# EAGLE design esp8266-rfid (EAGLE 7.7.0)
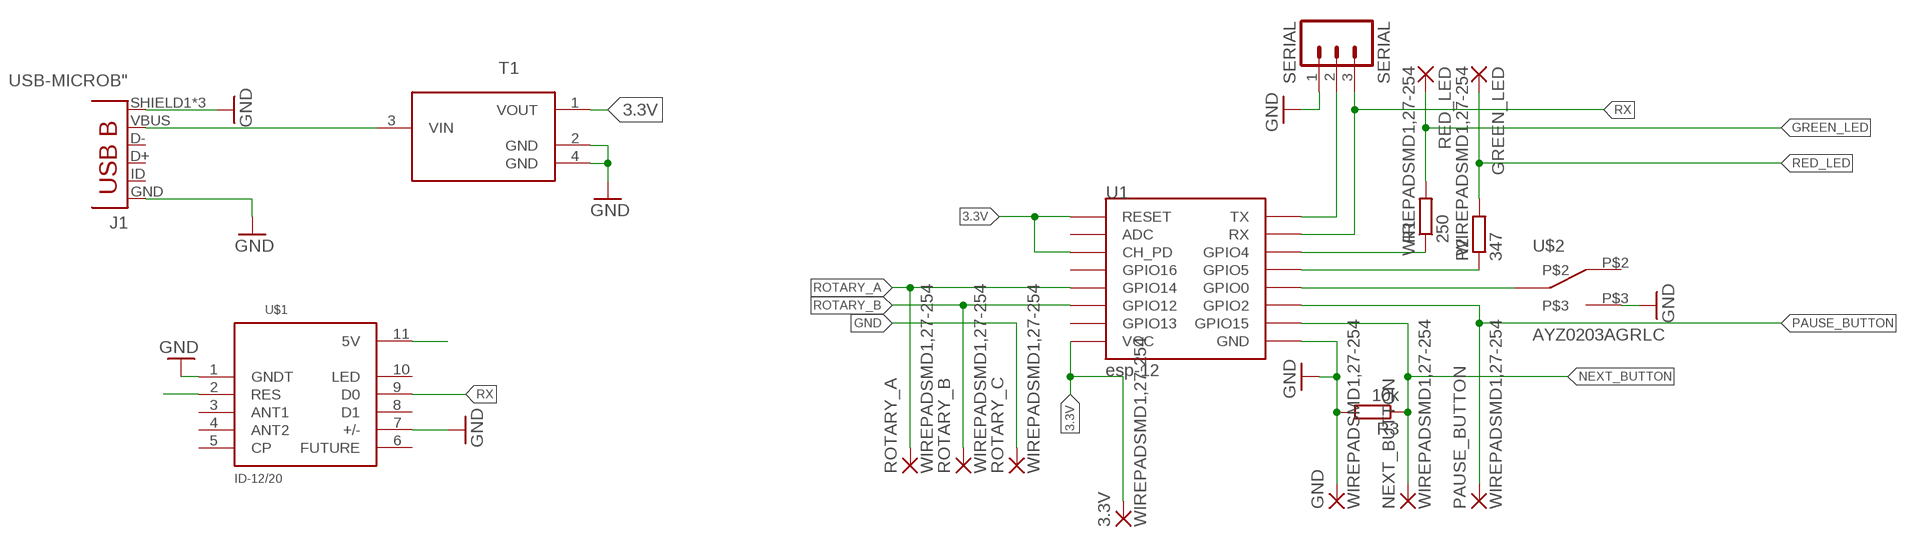
[diagram p0: schematic, sheet 1]

## Parts
3.3V  WIREPADSMD1,27-254  [SMD1,27-2,54]
GND  WIREPADSMD1,27-254  [SMD1,27-2,54]
GREEN_LED  WIREPADSMD1,27-254  [SMD1,27-2,54]
J1  USB-MICROB"  [USB-B-MICRO-SMD_V03]
NEXT_BUTTON  WIREPADSMD1,27-254  [SMD1,27-2,54]
PAUSE_BUTTON  WIREPADSMD1,27-254  [SMD1,27-2,54]
R1  250  R-EU_R0603  [R0603]
R2  347  R-EU_R0603  [R0603]
R3  10k  R-EU_R0603  [R0603]
RED_LED  WIREPADSMD1,27-254  [SMD1,27-2,54]
ROTARY_A  WIREPADSMD1,27-254  [SMD1,27-2,54]
ROTARY_B  WIREPADSMD1,27-254  [SMD1,27-2,54]
ROTARY_C  WIREPADSMD1,27-254  [SMD1,27-2,54]
SERIAL  SERIAL  M03PTH  [1X03]
T1  L78L33ACUTR  [SOT150P400X160-4N]
U1  esp-12  ESP12SMD  [ESP12-SMD]
U$1  ID-12/20  [ID-12]
U$2  AYZ0203AGRLC  [AYZ0203AGRLC]

## Nets
3.3V: 3.3V.1(P) T1.1(VOUT) U1.CH_PD U1.RESET U1.VCC
GND: GND.1(P) J1.GND J1.SHIELD1(SHIELD) J1.SHIELD2(SHIELD) J1.SHIELD3(SHIELD) R3.2 ROTARY_C.1(P) SERIAL.1 T1.2(GND) T1.4(GND) U1.GND U$1.1(GNDT) U$1.7(+/-) U$2.P$3
GREEN_LED: R1.2 RED_LED.1(P)
N$1: U1.GPIO0 U$2.P$1(COM)
N$7: R1.1 U1.GPIO4
NEXT_BUTTON: NEXT_BUTTON.1(P) R3.1 U1.GPIO15
PAUSE_BUTTON: PAUSE_BUTTON.1(P) U1.GPIO2
RED_LED: GREEN_LED.1(P) R2.2
RESET: R2.1 U1.GPIO5
ROTARY_A: ROTARY_A.1(P) U1.GPIO14
ROTARY_B: ROTARY_B.1(P) U1.GPIO12
RX: SERIAL.3 U1.RXD0(RX) U$1.9(D0)
TX: SERIAL.2 U1.TXD0(TX)
VBUS: J1.VBUS T1.3(VIN) U$1.2(RES) U$1.11(5V)
Unconnected: J1.D+ J1.D- J1.ID(USBID) U1.ADC U1.GPIO13 U1.GPIO16 U$1.3(ANT1) U$1.4(ANT2) U$1.5(CP) U$1.6(FUTURE) U$1.8(D1) U$1.10(LED) U$2.P$2

## Library data of the parts
3.3V GND GREEN_LED NEXT_BUTTON PAUSE_BUTTON RED_LED ROTARY_A ROTARY_B ROTARY_C = wirepad:WIREPAD: Wire PAD connect wire on PCB
J1 = SparkFun-Connectors:USB-MICROB: RED_PASTE version has 70% paste area under D+ D- USBID pins for applications where those pins aren't required, to reduce the likelihood of bridges.; PROD_ID: CONN-11752
R1-R3 = rcl:R-EU_: RESISTOR, European symbol
SERIAL = SparkFun-Connectors:M03: Header 3 Standard 3-pin 0.1" header. Use with straight break away headers (SKU : PRT-00116), right angle break away headers (PRT-00553), swiss pins (PRT-00743), machine pins (PRT-00117), and female headers (PRT-00115). Molex polarized connector foot print use with SKU : PRT-08232 with associated crimp pins and housings.
T1 = STM-STM8S003_L78LxxUTR:L78L: Positive voltage regulators(Output current up to 100 mA and Output voltages of 3.3; 5; 6; 8; 9; 10; 12; 15; 18;24 V); MPN: L78L33ACUTR; OC_FARNELL: 2253467; OC_NEWARK: 89K1361; PACKAGE: SOT-89; SUPPLIER: STMicroelectronics
U1 = esp8266modules:ESP12: ESP8266 Wifi module 12
U$1 = SparkFun-RF:ID-12/20: RFID reader for ID2, ID12, and ID20 Package
U$2 = AYZ0203AGRLC:AYZ0203AGRLC

## Board
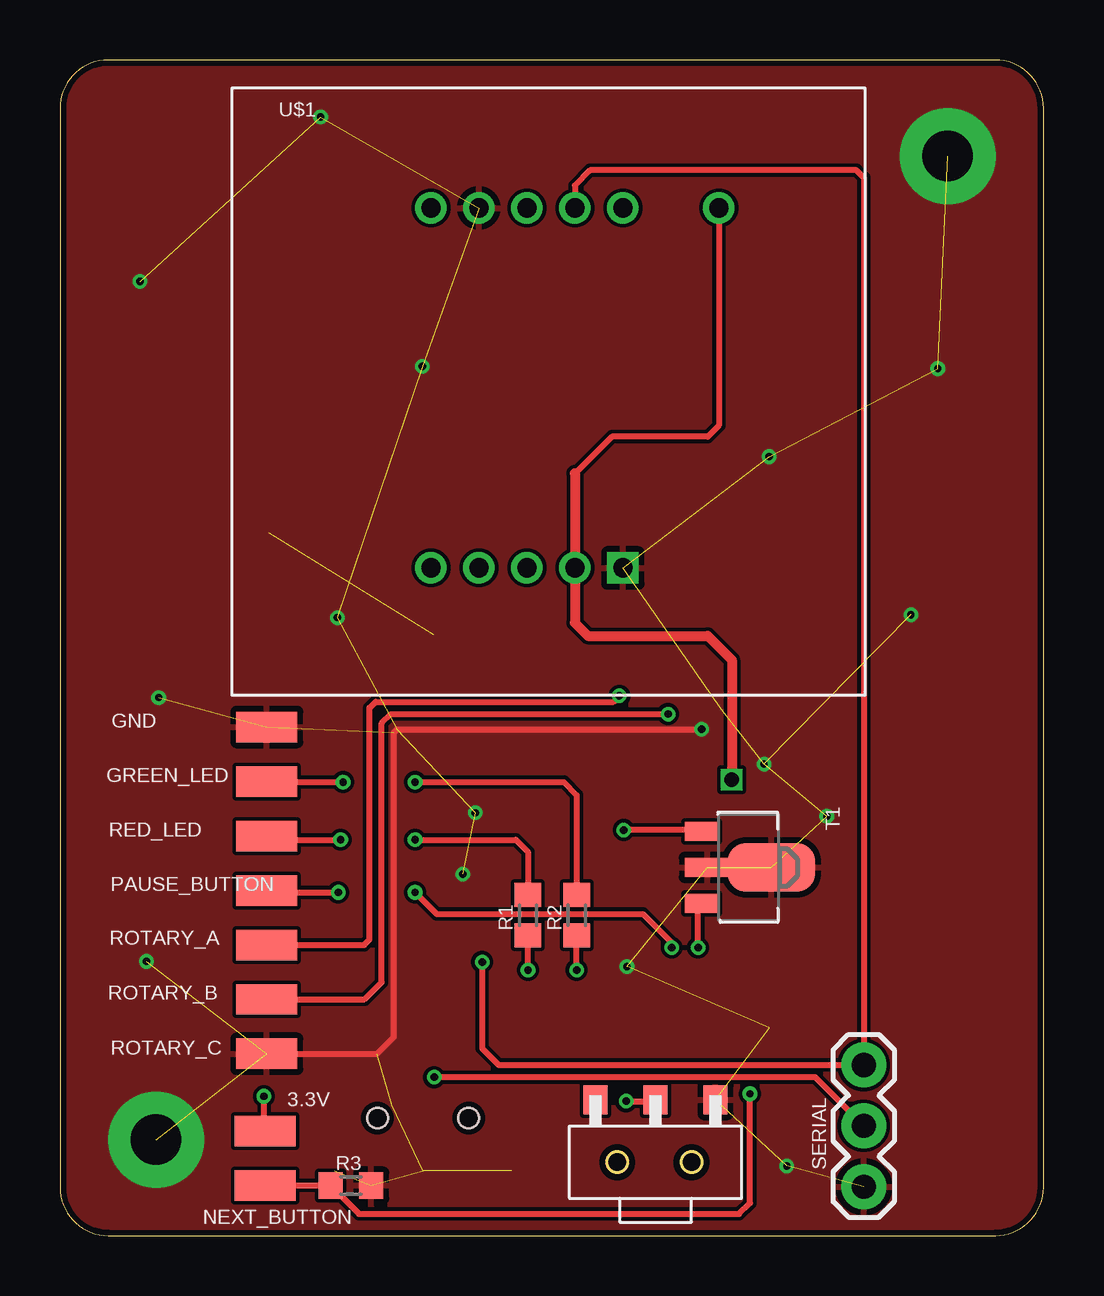
[diagram p1: board, top side]
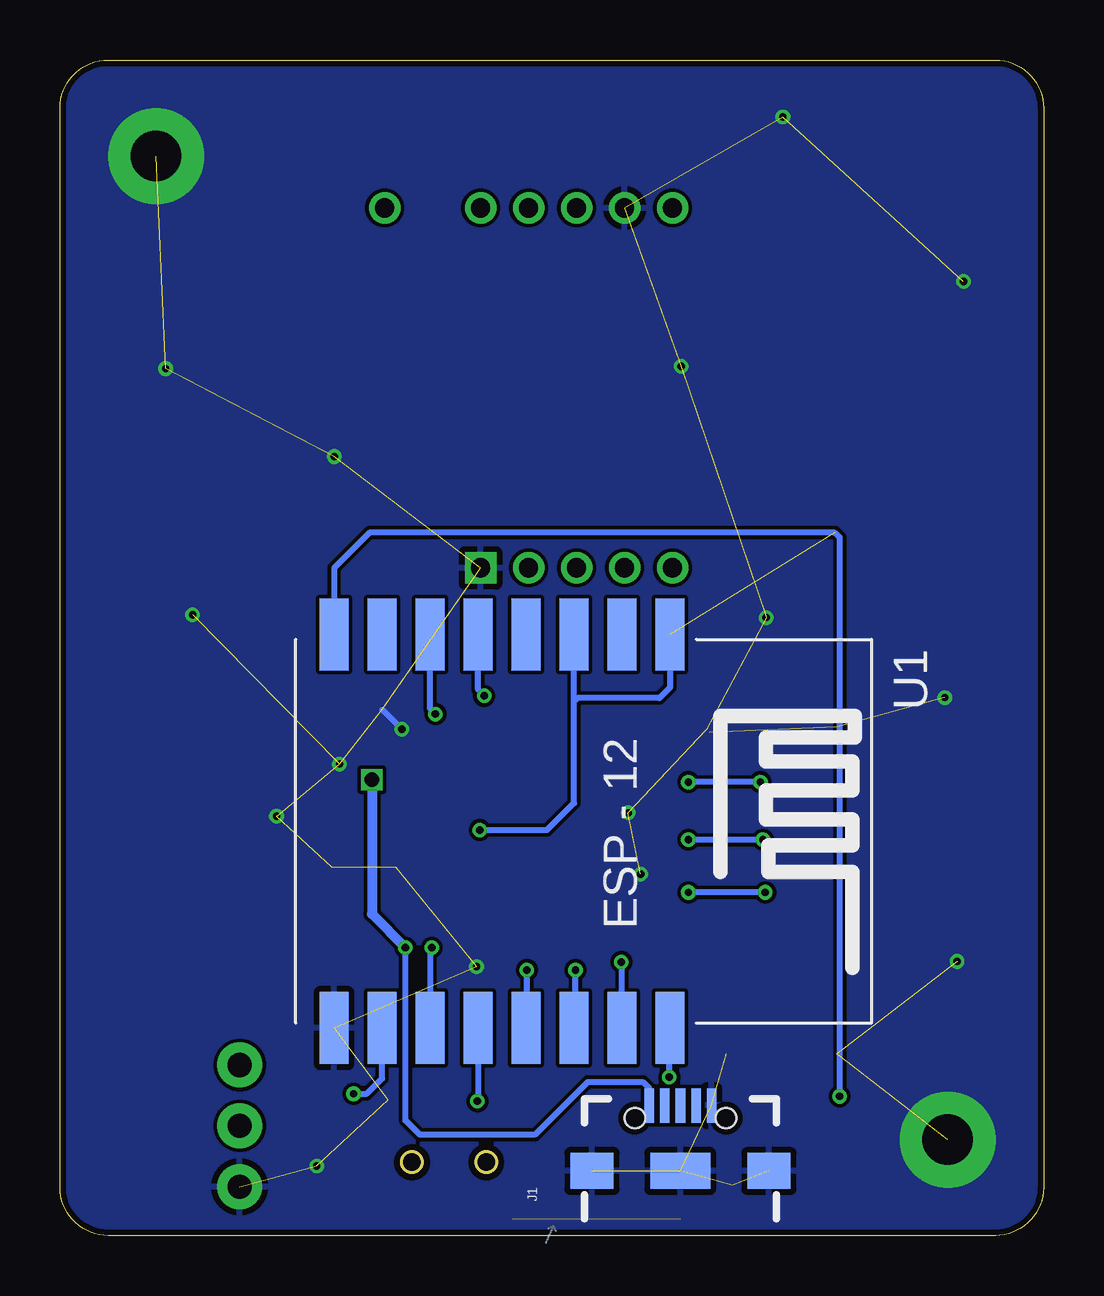
[diagram p2: board, bottom side, seen from below]

Size 41 x 49 mm. Coordinates in mm from the lower left corner, seen from the top.
Outline: 0,47 0,2 arc90 2,0 39,0 arc90 41,2 41,47 arc90 39,49 2,49 arc90 0,47
Copper layers (1*16): Top 0.035mm / dielectric 1.5mm / Bottom 0.035mm
Design rules "SeeedStudio_2layer_DRU": minimum track width 6mil, minimum drill 12mil, track to track 6mil, track to pad 6mil, pad to pad 6mil, via to via 6mil, smd to smd 0mil, copper to edge 10mil, drill to drill 10mil, minimum pad ring 10mil, minimum via ring 6mil, stop-mask expansion 2mil, vias tented up to drill 100mil, thermal gap 10mil

### Footprints (pad centres in the part's own frame; a part is rotated, then mirrored left to right if it is on the bottom)
SMD1,27-2,54 = smd 1.27 x 2.54: 1 0,0
USB-B-MICRO-SMD_V03 = smd 1.45 x 0.4: D+ 2.725,0; D- 2.725,0.65; GND 2.725,-1.3; ID 2.725,-0.65; VBUS 2.725,1.3 | smd 1.5 x 1.8: SHIELD1 0,3.685; SHIELD2 0,-3.685 | smd 1.5 x 2.5: SHIELD3 0,0 | hole 0.85: 2.2,1.9; 2.2,-1.9
R0603 = smd 1 x 1.1: 1 -0.85,0; 2 0.85,0
1X03 = drill 1.016 pad 1.88: 1 0,0; 2 2.54,0; 3 5.08,0
SOT150P400X160-4N = smd 0.8 x 1.4: 1 -1.499,-1.981; 3 1.499,-1.981 | smd 0.8 x 1.9: 2 0,-1.727 | smd 2.032 x 3.65: 4 0,0.94
ESP12-SMD = smd 3 x 1.2: ADC -8.3,3.8; CH_PD -8.3,1.8; GND 8.1,-8.2; GPIO0 8.1,-2.2; GPIO2 8.1,-4.2; GPIO4 8.1,1.8; GPIO5 8.1,-0.2; GPIO12 -8.3,-4.2; GPIO13 -8.3,-6.2; GPIO14 -8.3,-2.2; GPIO15 8.1,-6.2; GPIO16 -8.3,-0.2; RESET -8.3,5.8; RXD0 8.1,3.8; TXD0 8.1,5.8; VCC -8.3,-8.2
ID-12 = drill 0.8 square: 1 16.255,5.32 | drill 0.8: 2 14.255,5.32; 3 12.255,5.32; 4 10.255,5.32; 5 8.255,5.32; 6 8.255,20.32; 7 10.255,20.32; 8 12.255,20.32; 9 14.255,20.32; 10 16.255,20.32; 11 20.255,20.32
AYZ0203AGRLC = smd 1 x 1.2: P$1 0,2.6; P$2 -2.5,2.6; P$3 2.5,2.6

### Placement (x,y rotation side)
3.3V  8.55,4.35 270 top
GND  8.62,21.19 270 top
GREEN_LED  8.62,18.92 270 top
J1  15.14,2.69 90 bottom
NEXT_BUTTON  8.55,2.08 270 top
PAUSE_BUTTON  8.62,14.38 270 top
R1  19.51,13.35 90 top
R2  21.54,13.35 90 top
R3  12.13,2.08 0 top
RED_LED  8.62,16.65 270 top
ROTARY_A  8.62,12.11 270 top
ROTARY_B  8.62,9.84 270 top
ROTARY_C  8.62,7.57 270 top
SERIAL  33.51,2.03 90 top
T1  28.72,15.34 270 top
U1  21.37,16.75 270 bottom
U$1  7.21,22.51 0 top
U$2  24.82,3.05 0 top

### Tracks (layer width: path | path; a pad name or v marks a point on that pad's centre or on a via)
3.3V  (via drill 0.3)  (1 unrouted)
  Top 0.254: T1.1 26.68,16.9 v23.5,16.9 | 3.3V.1 8.5,4.41 v8.5,5.8
  Bottom 0.254: v23.5,16.9 20.7,16.9 19.57,18.03 19.57,22.25 | 19.57,22.25 U1.CH_PD | U1.RESET 15.57,22.85 16.02,22.4 19.42,22.4 19.57,22.25 | v8.5,5.8 8.5,29.1 8.7,29.3 28.1,29.3 29.57,27.83 U1.VCC
GND  (via drill 0.3, 2.1 pad 4)  (30 unrouted)
  Top 0.254: ROTARY_C.1 13.22,7.57 13.92,8.27 13.92,20.97 14.05,21.1 v26.75,21.1
  Bottom 0.254: v26.75,21.1 27.57,21.93
  other vias: 4,4 37,45 17.31,17.62 16.79,15.06 29.35,19.65 23.63,11.21 4.11,22.42 11.56,25.76 29.56,32.47 15.11,36.23 10.86,46.62 3.34,39.77 36.59,36.13 31.97,17.48 35.47,25.88 30.3,2.9 3.6,11.43
  pour Bottom: -3.7,-3.5 48.3,-3.5 48.3,63.5 -3.7,63.5
  pour Top: -3.7,-3.4 48.3,-3.4 48.3,63.6 -3.7,63.6
GREEN_LED  (via drill 0.3)
  Top 0.254: RED_LED.1 8.77,16.5 v11.7,16.5 | v14.8,16.5 19,16.5 19.51,15.99 R1.2
  Bottom 0.254: v11.7,16.5 v14.8,16.5
N$1  (via drill 0.3)
  Top 0.254: v23.6,5.6 24.77,5.6 U$2.P$1
  Bottom 0.254: U1.GPIO0 23.57,5.63 v23.6,5.6
N$7  (via drill 0.3)
  Top 0.254: v19.51,11.07 R1.1
  Bottom 0.254: U1.GPIO4 19.51,8.72 v19.51,11.07
NEXT_BUTTON  (via drill 0.3)
  Top 0.254: NEXT_BUTTON.1 R3.1 12.46,0.9 28.31,0.9 28.76,1.35 v28.76,5.91
  Bottom 0.254: v28.76,5.91 28.21,5.91 27.57,6.55 U1.GPIO15
PAUSE_BUTTON  (via drill 0.3)
  Top 0.254: PAUSE_BUTTON.1 8.7,14.3 v11.6,14.3 | v14.8,14.3 15.7,13.4 24.3,13.4 25.5,12.2 v25.5,12
  Bottom 0.254: v11.6,14.3 v14.8,14.3 | v25.5,12 25.57,11.93 U1.GPIO2
RED_LED  (via drill 0.3)
  Top 0.254: GREEN_LED.1 8.64,18.9 v11.8,18.9 | v14.8,18.9 21,18.9 21.54,18.36 R2.2
  Bottom 0.254: v11.8,18.9 v14.8,18.9
RESET  (via drill 0.3)
  Top 0.254: v21.54,11.07 R2.1
  Bottom 0.254: U1.GPIO5 21.54,8.68 v21.54,11.07
ROTARY_A  (via drill 0.3)
  Top 0.254: ROTARY_A.1 12.68,12.11 12.9,12.34 12.9,21.99 13.16,22.24 23.06,22.24 v23.32,22.5
  Bottom 0.254: v23.32,22.5 23.57,22.75 U1.GPIO14
ROTARY_B  (via drill 0.3)
  Top 0.254: ROTARY_B.1 12.7,9.84 13.41,10.56 13.41,21.36 13.79,21.74 v25.35,21.74
  Bottom 0.254: v25.35,21.74 25.57,21.96 U1.GPIO12
RX  (via drill 0.3)
  Top 0.254: v17.6,11.4 17.6,7.8 18.29,7.11 SERIAL.3 33.51,44.09 33.2,44.4 22.1,44.4 21.46,43.77 U$1.9
  Bottom 0.254: U1.RXD0 17.57,11.37 v17.6,11.4
TX  (via drill 0.3)
  Top 0.254: SERIAL.2 31.48,6.6 v15.6,6.6
  Bottom 0.254: v15.6,6.6 15.6,8.62 U1.TXD0
VBUS  (via drill 0.3, 0.6)
  Top 0.254: v26.6,12 26.6,13.7 T1.3 | U$1.11 27.46,33.77 27,33.3 23,33.3 21.46,31.77
  Top 0.406: 21.46,31.77 U$1.2 21.46,25.54 22,25 27,25 28,24 v28,19
  Bottom 0.254: v26.6,12 26.6,4.8 26,4.2 21.2,4.2 19,6.4 16.7,6.4 16.44,6.14 J1.VBUS
  Bottom 0.406: v28,19 28,13.4 v26.6,12

### Text on the board
tDocu: Kodi-RFID / rev 0 / / M.Lauters | Rx | Tx